# EAGLE design S2EC13 (EAGLE 7.4.0)
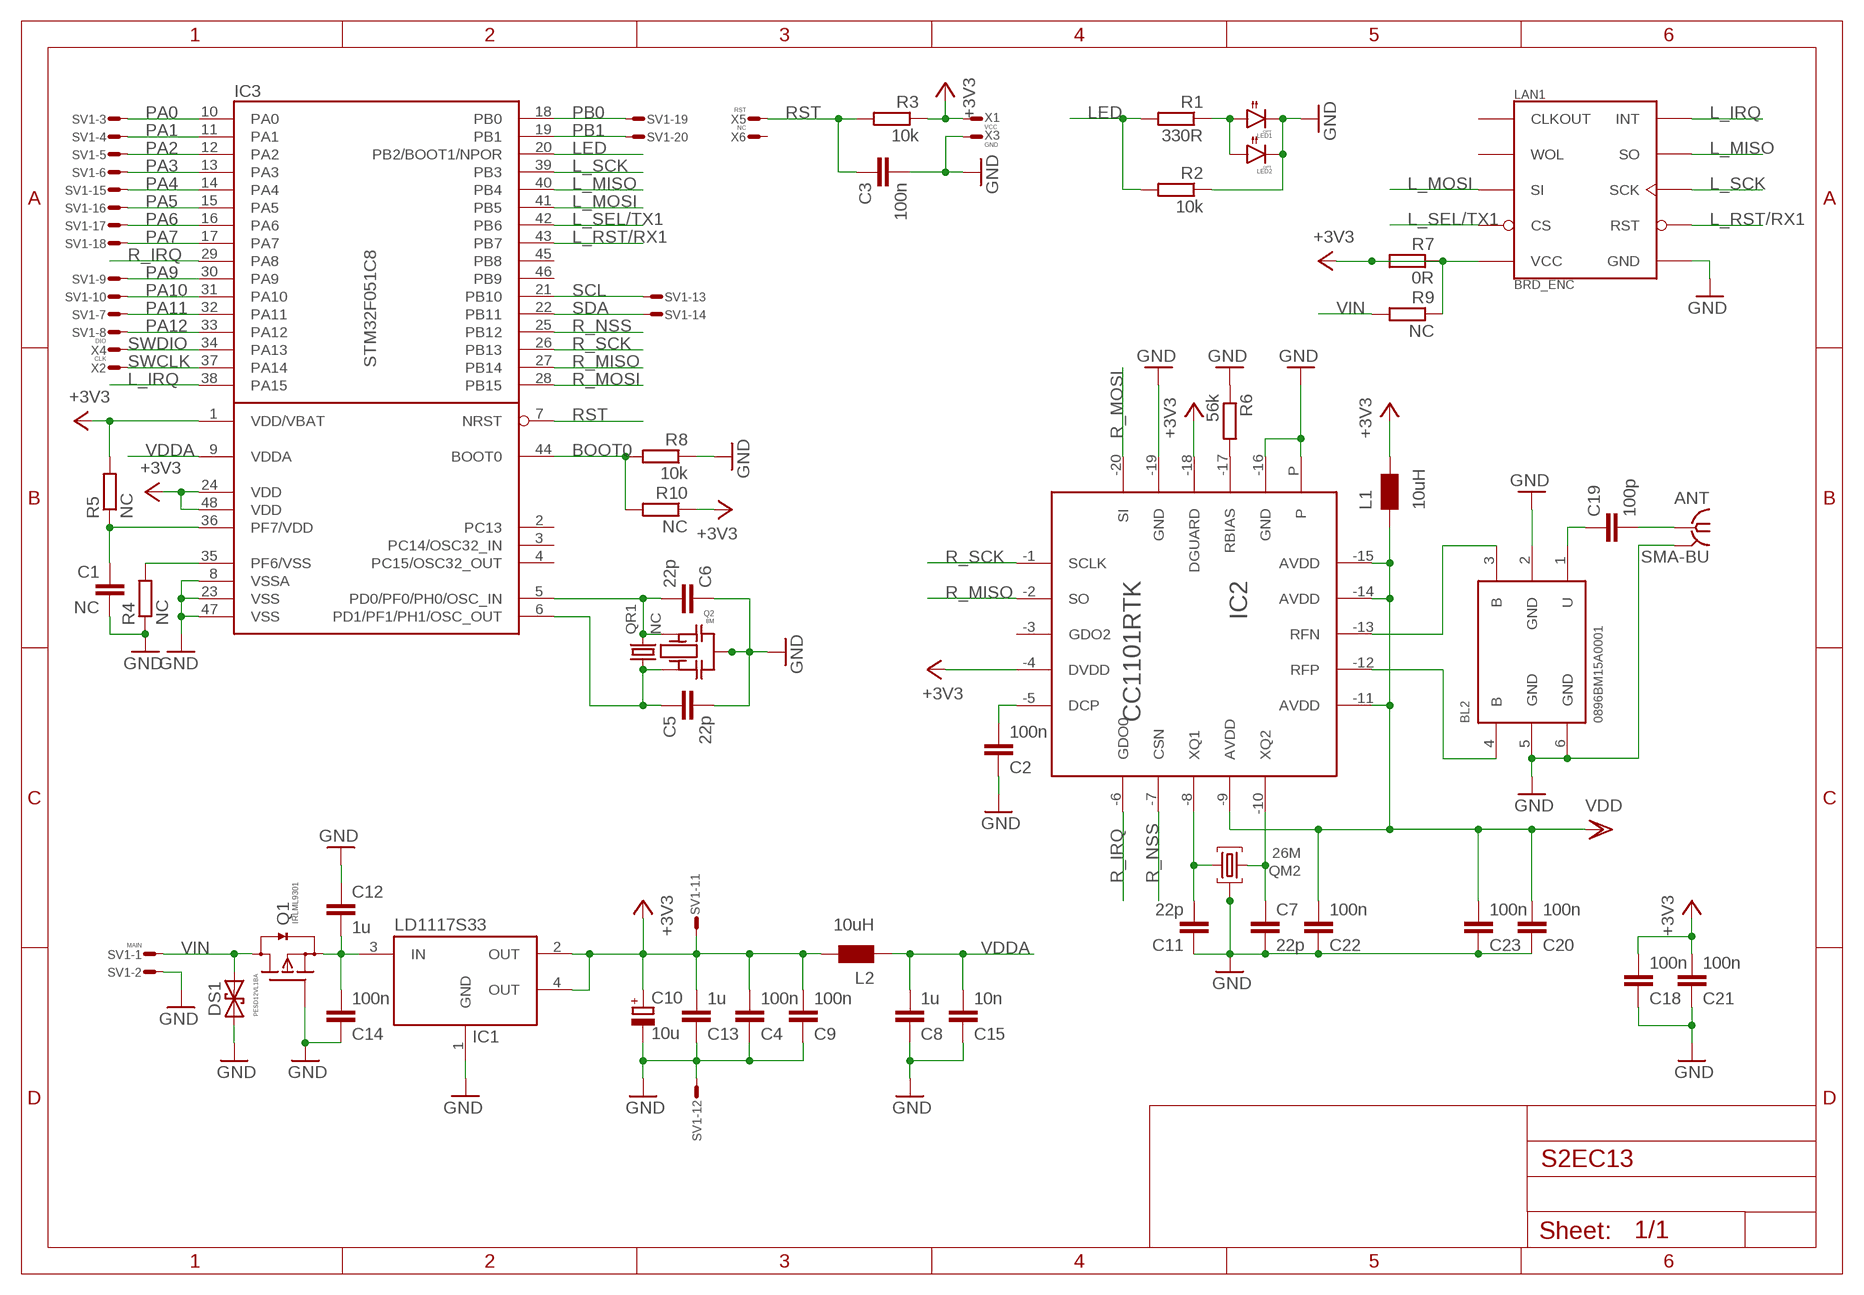
[diagram p0: schematic, sheet 1]

## Parts
ANT  SMA-BU  [BU-SMA-V]
BL2  0896BM15A0001  BL  [BL]
C1  NC  C0603  [0603]
C2  100n  C0603  [0603]
C3  100n  C0603  [0603]
C4  100n  C0603  [0603]
C5  22p  C0603  [0603]
C6  22p  C0603  [0603]
C7  22p  C0603  [0603]
C8  1u  C0603  [0603]
C9  100n  C0603  [0603]
C10  10u  C_POLSMCA  [SMC_A]
C11  22p  C0603  [0603]
C12  1u  C0603  [0603]
C13  1u  C0603  [0603]
C14  100n  C0603  [0603]
C15  10n  C0603  [0603]
C18  100n  C0603  [0603]
C19  100p  C0603  [0603]
C20  100n  C0603  [0603]
C21  100n  C0603  [0603]
C22  100n  C0603  [0603]
C23  100n  C0603  [0603]
DS1  PESD12VL1BA  TVS-U323  [SOD323]
IC1  LD1117S33  LDO_4P  [SOT223]
IC2  CC1101RTK  CC110LV  [VQFN20]
IC3  STM32F051C8  STM32_LQFP48  [LQFP48]
L1  10uH  L0603  [0603]
L2  10uH  L0603  [0603]
LAN1  BRD_ENC  [BRD_ENC]
LED1  OPT  LEDT134  [T1-3/4]
LED2  OPT  LED1206  [1206]
Q1  IRLML9301  FET-PDSOT23  [SOT23]
Q2  8M  QRCE  [CSTCE]
QM2  26M  QM3.2X2.5  [SMD_4P_3.2X2.5]
QR1  NC  QABS07  [ABS07]
R1  330R  R0603  [0603]
R2  10k  R0603  [0603]
R3  10k  R0603  [0603]
R4  NC  R0603  [0603]
R5  NC  R0603  [0603]
R6  56k  R0603  [0603]
R7  0R  R0603  [0603]
R8  10k  R0603  [0603]
R9  NC  R0603  [0603]
R10  NC  R0603  [0603]
SV1  MAIN  ML20LSE  [ML20LS]
X1  VCC  WIREPADT1.6/0.9  [T1.6/0.9]
X2  CLK  WIREPADT1.6/0.9  [T1.6/0.9]
X3  GND  WIREPADT1.6/0.9  [T1.6/0.9]
X4  DIO  WIREPADT1.6/0.9  [T1.6/0.9]
X5  RST  WIREPADT1.6/0.9  [T1.6/0.9]
X6  NC  WIREPADT1.6/0.9  [T1.6/0.9]

## Nets
+3V3: C4.2 C9.2 C10.+ C13.2 C18.2 C21.2 IC1.2(OUT) IC1.4(OUT) IC2.-4(DVDD) IC2.-18(DGUARD) IC3.1(VDD/VBAT) IC3.24(VDD) IC3.48(VDD) L1.2 L2.2 LAN1.P$9(VCC) R3.1 R5.2 R7.1 R7.2 R9.1 R10.1 SV1.P$11 X1.1(S)
BOOT0: IC3.44(BOOT0) R8.2 R10.2
GND: ANT.2 ANT.3 ANT.4 ANT.5 BL2.2(GND) BL2.5(GND) BL2.6(GND) C1.2 C2.1 C3.2 C4.1 C5.2 C6.1 C7.2 C8.1 C9.1 C10.- C11.1 C12.1 C13.1 C14.1 C15.1 C18.1 C20.1 C21.1 C22.1 C23.1 DS1.A IC1.1(GND) IC2.-16(GND) IC2.-19(GND) IC2.P IC3.8(VSSA) IC3.23(VSS) IC3.47(VSS) LAN1.P$10(GND) LED1.C LED2.2(C) Q1.1(G) Q2.G(M) QM2.2(M1) QM2.4(M2) R2.1 R4.1 R6.1 R8.1 SV1.P$2 SV1.P$12 X3.1(S)
L_IRQ: IC3.38(PA15) LAN1.P$2(INT)
L_MISO: IC3.40(PB4) LAN1.P$4(SO)
L_MOSI: IC3.41(PB5) LAN1.P$5(SI)
L_RST/RX1: IC3.43(PB7) LAN1.P$8(RST)
L_SCK: IC3.39(PB3) LAN1.P$6(SCK)
L_SEL/TX1: IC3.42(PB6) LAN1.P$7(CS)
LED: IC3.20(PB2/BOOT1/NPOR) R1.2 R2.2
N$1: LED1.A LED2.1(A) R1.1
N$2: IC3.35(PF6/VSS) R4.2
N$3: C1.1 IC3.36(PF7/VDD) R5.1
N$6: IC2.-17(RBIAS) R6.2
N$7: C2.2 IC2.-5(DCP)
N$8: BL2.3(B) IC2.-13(RFN)
N$9: BL2.4(B) IC2.-12(RFP)
N$11: C11.2 IC2.-8(XQ1) QM2.3
N$12: C7.1 IC2.-10(XQ2) QM2.1
N$13: BL2.1(U) C19.1
N$14: ANT.1 C19.2
N$20: C6.2 IC3.5(PD0/PF0/PH0/OSC_IN) Q2.A QR1.P$2
N$21: C5.1 IC3.6(PD1/PF1/PH1/OSC_OUT) Q2.B QR1.P$1
N$31: C12.2 C14.2 IC1.3(IN) Q1.2(S)
PA0: IC3.10(PA0) SV1.P$3
PA1: IC3.11(PA1) SV1.P$4
PA2: IC3.12(PA2) SV1.P$5
PA3: IC3.13(PA3) SV1.P$6
PA4: IC3.14(PA4) SV1.P$15
PA5: IC3.15(PA5) SV1.P$16
PA6: IC3.16(PA6) SV1.P$17
PA7: IC3.17(PA7) SV1.P$18
PA9: IC3.30(PA9) SV1.P$9
PA10: IC3.31(PA10) SV1.P$10
PA11: IC3.32(PA11) SV1.P$7
PA12: IC3.33(PA12) SV1.P$8
PB0: IC3.18(PB0) SV1.P$19
PB1: IC3.19(PB1) SV1.P$20
R_IRQ: IC2.-6(GDO0) IC3.29(PA8)
R_MISO: IC2.-2(SO) IC3.27(PB14)
R_MOSI: IC2.-20(SI) IC3.28(PB15)
R_NSS: IC2.-7(CSN) IC3.25(PB12)
R_SCK: IC2.-1(SCLK) IC3.26(PB13)
RST: C3.1 IC3.7(NRST) R3.2 X5.1(S)
SCL: IC3.21(PB10) SV1.P$13
SDA: IC3.22(PB11) SV1.P$14
SWCLK: IC3.37(PA14) X2.1(S)
SWDIO: IC3.34(PA13) X4.1(S)
VDD: C20.2 C22.2 C23.2 IC2.-9(AVDD) IC2.-11(AVDD) IC2.-14(AVDD) IC2.-15(AVDD) L1.1
VDDA: C8.2 C15.2 IC3.9(VDDA) L2.1
VIN: DS1.C Q1.3(D) R9.2 SV1.P$1
Unconnected: IC2.-3(GDO2) IC3.2(PC13) IC3.3(PC14/OSC32_IN) IC3.4(PC15/OSC32_OUT) IC3.45(PB8) IC3.46(PB9) LAN1.P$1(CLKOUT) LAN1.P$3(WOL) X6.1(S)

## Library data of the parts
ANT = Conn:SMA-: SMA 50 Ohm End Launch Jack Receptacle - Round Contact Johnson Components Source: www.johnsoncomponents.com .. J502-ND.pdf
BL2 = RF:BL
C1-C9 C11-C15 C18-C23 = RCL:C: Capacitor SMD
C10 = RCL:C_POL: POLARIZED CAPACITOR, European symbol
DS1 = Diode:TVS-U: DIODE
IC1 = DCDC:LDO_4P
IC2 = RF:CC110L
IC3 = STM32:STM32_LQFP48
L1 L2 = RCL:L
LAN1 = brd_enc:BRD_ENC
LED1 LED2 = Optic:LED
Q1 = Transistor:FET-PD
Q2 = QUARTZ:QR
QM2 = QUARTZ:QM
QR1 = QUARTZ:Q
R1-R10 = RCL:R: Resistor SMD
SV1 = Conn:ML20?E: HARTING
X1-X6 = Conn:WIREPAD: Wire PAD connect wire on PCB

## Board
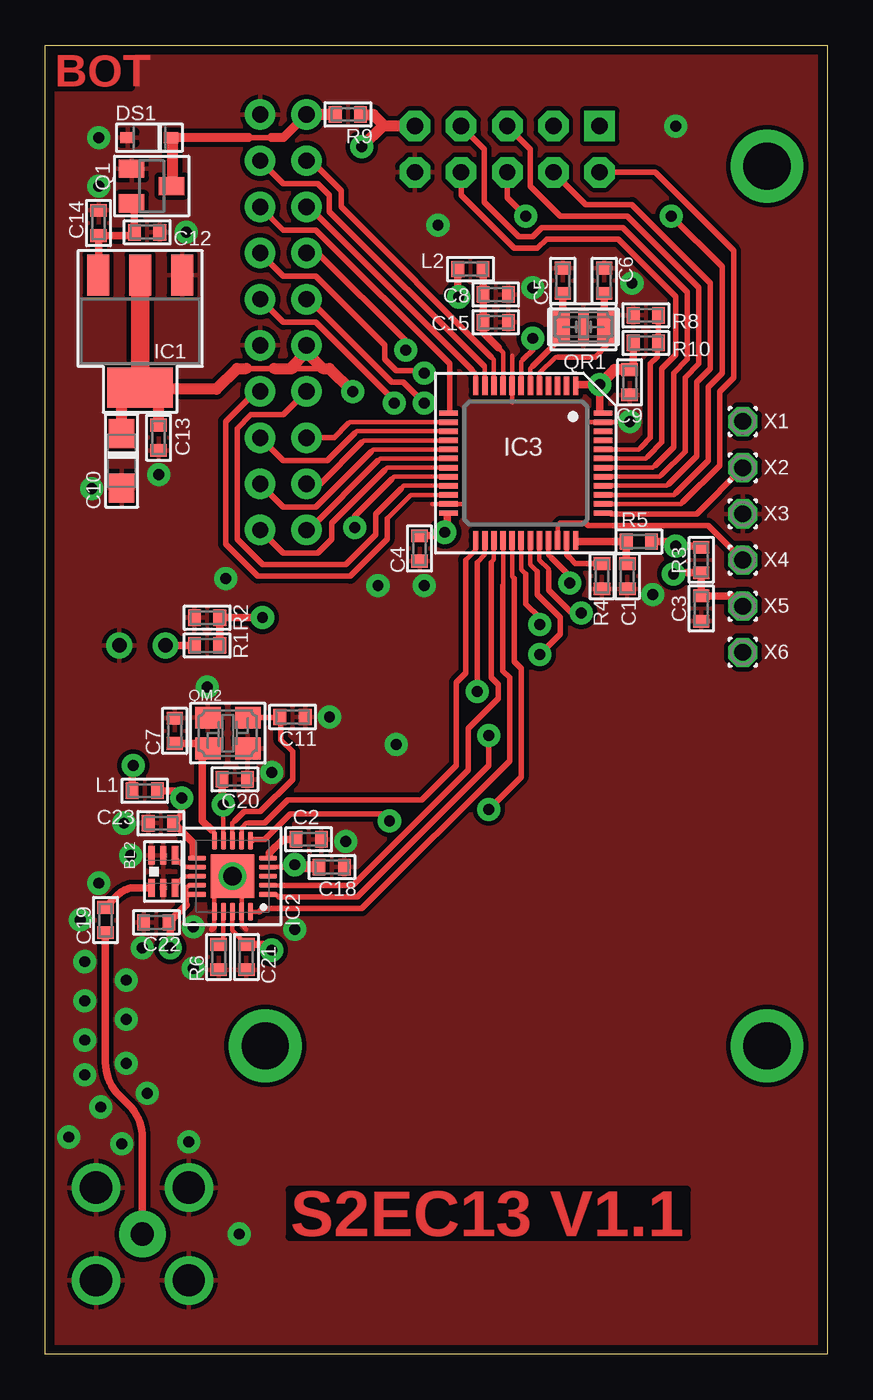
[diagram p1: board, top side]
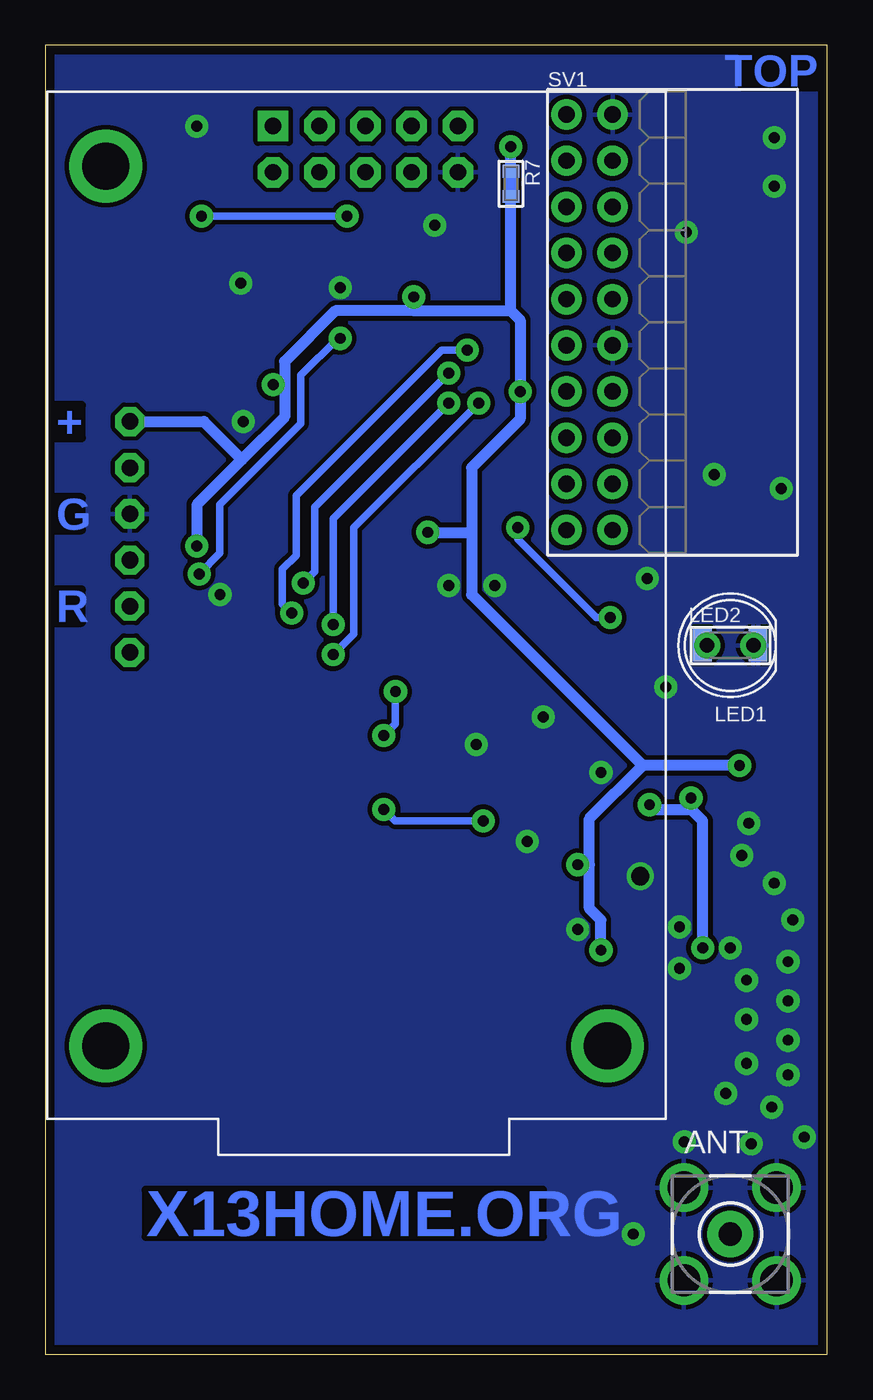
[diagram p2: board, bottom side, seen from below]

Size 43 x 72 mm. Coordinates in mm from the lower left corner, seen from the top.
Outline: 43,0 0,0 0,72 43,72 43,0
Copper layers (1*16): Top 0.035mm / dielectric 1.5mm / Bottom 0.035mm
Design rules "default *": minimum track width 12mil, minimum drill 0.5mm, track to track 10mil, track to pad 10mil, pad to pad 6mil, via to via 10mil, smd to smd 6mil, copper to edge 20mil, drill to drill 8mil, minimum pad ring 10mil, minimum via ring 8mil, stop-mask expansion 2mil, vias tented up to drill 25mil, thermal gap 10mil
tKeepout: area 0,0 to 43,2.5; area 0,69.5 to 43,72
bKeepout: area 0,0 to 43,1.3; area 0,70.7 to 43,72

### Footprints (pad centres in the part's own frame; a part is rotated, then mirrored left to right if it is on the bottom)
BU-SMA-V = drill 1.27 pad 2.54: 1 0,0 | drill 1.778: 2 -2.55,2.55; 3 2.55,2.55; 4 2.55,-2.55; 5 -2.55,-2.55
BL = smd 1 x 0.35: 1 0.9,-0.65; 2 0.9,0; 3 0.9,0.65; 4 -0.9,0.65; 5 -0.9,0; 6 -0.9,-0.65
0603 = smd 0.7 x 0.9: 1 -0.697,0; 2 0.697,0
SMC_A = smd 1.6 x 1.4: + -1.5,0; - 1.5,0
SOD323 = smd 0.8 x 0.6: A 1.2,0; C -1.2,0
SOT223 = smd 1.219 x 2.235: 1 -2.311,-3.099; 2 0,-3.099; 3 2.311,-3.099 | smd 3.6 x 2.2: 4 0,3.099
VQFN20 = smd 0.28 x 1: -1 -1,-1.95; -2 -0.5,-1.95; -3 0,-1.95; -4 0.5,-1.95; -5 1,-1.95; -11 1,1.95; -12 0.5,1.95; -13 0,1.95; -14 -0.5,1.95; -15 -1,1.95 | smd 1 x 0.28: -6 1.95,-1; -7 1.95,-0.5; -8 1.95,0; -9 1.95,0.5; -10 1.95,1; -16 -1.95,1; -17 -1.95,0.5; -18 -1.95,0; -19 -1.95,-0.5; -20 -1.95,-1 | smd 2.4 x 2.4: P 0,0
LQFP48 = smd 0.3 x 1: 1 -2.75,-4.25; 2 -2.25,-4.25; 3 -1.75,-4.25; 4 -1.25,-4.25; 5 -0.75,-4.25; 6 -0.25,-4.25; 7 0.25,-4.25; 8 0.75,-4.25; 9 1.25,-4.25; 10 1.75,-4.25; 11 2.25,-4.25; 12 2.75,-4.25; 25 2.75,4.25; 26 2.25,4.25; 27 1.75,4.25; 28 1.25,4.25; 29 0.75,4.25; 30 0.25,4.25; 31 -0.25,4.25; 32 -0.75,4.25; 33 -1.25,4.25; 34 -1.75,4.25; 35 -2.25,4.25; 36 -2.75,4.25 | smd 1 x 0.3: 13 4.25,-2.75; 14 4.25,-2.25; 15 4.25,-1.75; 16 4.25,-1.25; 17 4.25,-0.75; 18 4.25,-0.25; 19 4.25,0.25; 20 4.25,0.75; 21 4.25,1.25; 22 4.25,1.75; 23 4.25,2.25; 24 4.25,2.75; 37 -4.25,2.75; 38 -4.25,2.25; 39 -4.25,1.75; 40 -4.25,1.25; 41 -4.25,0.75; 42 -4.25,0.25; 43 -4.25,-0.25; 44 -4.25,-0.75; 45 -4.25,-1.25; 46 -4.25,-1.75; 47 -4.25,-2.25; 48 -4.25,-2.75
BRD_ENC = drill 0.9 pad 1.676 square: P$1 21.59,54.61 | drill 0.9 pad 1.676 octagon: P$2 21.59,52.07; P$3 19.05,54.61; P$4 19.05,52.07; P$5 16.51,54.61; P$6 16.51,52.07; P$7 13.97,54.61; P$8 13.97,52.07; P$9 11.43,54.61; P$10 11.43,52.07 | drill 2.6 pad 4: PAD@1 3.2,4; PAD@2 30.8,4; PAD@3 30.8,52.4
T1-3/4 = drill 0.8 pad 1.422: A 1.27,0; C -1.27,0
1206 = smd 1.016 x 1.778: 1 -1.524,0; 2 1.524,0
SOT23 = smd 1 x 1.4: 1 -0.95,-1.1; 2 0.95,-1.1; 3 0,1.1
CSTCE = smd 0.6 x 2: A -1.2,0; B 1.2,0; G 0,0
SMD_4P_3.2X2.5 = smd 1.4 x 1.2: 1 -1.1,-0.85; 2 1.1,-0.85; 3 1.1,0.85; 4 -1.1,0.85
ABS07 = smd 1 x 1.8: P$1 -1.25,0; P$2 1.25,0
ML20LS = drill 0.9 pad 1.676: P$1 -11.43,-1.27; P$2 -11.43,1.27; P$3 -8.89,-1.27; P$4 -8.89,1.27; P$5 -6.35,-1.27; P$6 -6.35,1.27; P$7 -3.81,-1.27; P$8 -3.81,1.27; P$9 -1.27,-1.27; P$10 -1.27,1.27; P$11 1.27,-1.27; P$12 1.27,1.27; P$13 3.81,-1.27; P$14 3.81,1.27; P$15 6.35,-1.27; P$16 6.35,1.27; P$17 8.89,-1.27; P$18 8.89,1.27; P$19 11.43,-1.27; P$20 11.43,1.27
T1.6/0.9 = drill 0.914 pad 1.6 octagon: 1 0,0

### Placement (x,y rotation side)
ANT  5.33,6.6 0 bottom
BL2  6.48,26.54 270 top
C1  32,42.8 270 top
C2  14.48,28.32 180 top
C3  36.07,41.02 270 top
C4  20.57,44.32 90 top
C5  28.45,59.05 90 top
C6  30.73,59.05 270 top
C7  7.11,34.29 90 top
C8  24.77,58.29 180 top
C9  32.13,53.47 90 top
C10  4.19,49.15 270 top
C11  13.59,35.05 180 top
C12  5.59,61.72 180 top
C13  6.22,50.42 90 top
C14  2.92,62.23 270 top
C15  24.77,56.77 180 top
C18  15.75,26.8 180 top
C19  3.3,23.88 270 top
C20  10.41,31.62 180 top
C21  11.05,21.84 90 top
C22  6.1,23.75 0 top
C23  6.35,29.21 0 top
DS1  5.71,66.93 180 top
IC1  5.21,56.26 180 top
IC2  10.29,26.29 90 top
IC3  26.42,49.02 180 top
L1  5.46,30.99 180 top
L2  23.37,59.69 180 top
LAN1  8.89,12.95 0 top
LED1  5.33,38.99 180 bottom
LED2  5.33,38.99 0 bottom
Q1  5.84,64.26 270 top
Q2  29.59,56.52 180 top
QM2  10.03,34.16 0 top
QR1  29.59,56.52 0 top
R1  8.89,38.99 0 top
R2  8.89,40.51 0 top
R3  36.07,43.69 270 top
R4  30.61,42.8 90 top
R5  32.64,44.7 0 top
R6  9.53,21.84 90 top
R7  17.4,64.39 270 bottom
R8  33.02,57.15 0 top
R9  16.64,68.2 180 top
R10  33.02,55.63 0 top
SV1  13.08,56.77 270 bottom
X1  38.35,51.31 0 top
X2  38.35,48.77 0 top
X3  38.35,46.23 0 top
X4  38.35,43.69 0 top
X5  38.35,41.15 0 top
X6  38.35,38.61 0 top

### Tracks (layer width: path | path; a pad name or v marks a point on that pad's centre or on a via)
+3V3  (via drill 0.6 pad 1.27)
  Top 0.254: IC3.1 29.27,53.27 | IC2.-18 10.29,23.3 C21.2 | IC3.24 22.17,46.17 22.1,46.1 | IC3.48 30.65,51.77 30.48,51.94 | IC2.-4 12.95,26.79 12.95,26.8
  Top 0.305: 29.27,53.27 29.34,53.34 | 11.05,54.23 12.57,54.23 | 13.59,54.23 15.24,54.23 | 32.32,54.36 C9.2 | 12.95,26.8 13.59,26.8 v13.72,26.92
  Top 0.406: 29.34,53.34 v30.48,53.34 30.48,51.94 | C4.2 21.78,45.02 v21.97,45.21 22.1,45.34 22.1,46.1 | v22.73,58.17 22.67,58.23 L2.2 | C21.2 12.13,22.54 v12.45,22.23 | L1.2 4.76,32.32 v4.83,32.38 | R10.1 32.32,54.36 | R5.2 34.42,44.7 v34.67,44.45 36,44.45 R3.1
  Top 0.61: 6.1,53.09 9.4,53.09 10.54,54.23 11.05,54.23 | 6.1,53.09 5.28,53.09 IC1.4 5.13,53.09 4.19,53.09 C10.+ | v16.89,52.96 15.62,54.23 15.24,54.23 14.35,55.12 | LAN1.P$9 18.67,67.56 | 18.67,67.56 18.54,67.56 v17.4,66.42 | C13.2 6.22,52.96 6.1,53.09 | R9.1 18.03,68.2 18.67,67.56 | 12.57,54.23 13.46,54.23 | 13.46,54.23 13.59,54.23 | SV1.P$11 14.35,55.12 | 14.35,55.12 13.46,54.23 | v30.48,53.34 31.3,54.16 C9.2 | C18.2 13.84,26.8 v13.72,26.92
  Top 1.016: IC1.2 IC1.4
  Bottom 0.61: v4.83,32.38 10.16,32.38 | 19.56,45.21 19.56,48.77 16.89,51.44 v16.89,52.96 16.89,56.9 17.4,57.4 | v21.97,45.21 19.56,45.21 | 19.56,45.21 19.56,41.78 10.16,32.38 | 22.73,57.4 17.4,57.4 | 17.4,57.4 R7.2 R7.1 v17.4,66.42 | v22.73,58.17 22.73,57.4 | 29.84,53.34 29.84,54.61 27.05,57.4 22.73,57.4 | 29.84,53.34 29.84,51.56 32.19,49.21 | 32.19,49.21 34.67,46.74 v34.67,44.45 | X1.1 34.29,51.31 32.19,49.21 | v30.48,53.34 29.84,53.34 | v12.45,22.23 12.45,23.88 13.08,24.51 13.08,26.92 | 13.08,26.92 13.08,29.46 10.16,32.38 | v13.72,26.92 13.08,26.92
BOOT0
  Top 0.254: IC3.44 32.63,49.77 32.77,49.91
  Top 0.305: 32.77,49.91 33.27,50.42 33.27,54.48 33.66,54.86 33.66,55.56 R10.2 R8.2
GND  (via drill 0.6 pad 1.27, 1 pad 1.27)
  Top 0.254: 25.67,52.34 IC3.8 25.67,54.92 | IC3.47 31.41,51.27 | 29.9,51.27 30.64,51.27 | 22.95,46.77 IC3.23 21.28,46.77 | 9.29,25.16 IC2.-16 9.29,23.51 | 10.79,25.79 IC2.-19 10.79,23.63 11.05,23.37
  Top 0.305: 10.79,25.79 IC2.P | 9.29,23.51 9.14,23.37
  other vias: 2.92,66.93 32.13,51.31 26.8,58.67 32.26,58.93 12.45,32 16.51,28.19 10.29,26.29 5.33,22.35 13.72,23.37 8.13,23.5 4.7,27.43 4.32,29.21 7.75,61.72 6.22,48.39 20.83,42.29 18.29,42.29 33.4,41.78 34.67,67.56 15.62,35.05 8.89,36.7 21.59,62.1 9.91,42.67 2.54,47.62 19.3,33.53 8.13,21.21 4.45,20.57 4.45,18.41 4.45,16 5.59,14.35 7.87,11.68 10.67,6.6 4.19,11.56 3.05,13.59 2.16,17.27 2.16,19.43 2.16,21.59 2.92,25.91 1.91,23.88 1.27,11.94 2.16,15.37 2.92,64.26
  pour Bottom: 43,0 0,0 0,72 43,72
  pour Top: 43,0 0,0 0,72 43,72
L_IRQ
  Top 0.254: IC3.38 34.96,46.77 35.05,46.86
  Top 0.305: LAN1.P$2 33.53,65.02 37.85,60.71 37.85,53.72 37.08,52.96 37.08,48.9 35.05,46.86
L_MISO
  Top 0.254: IC3.40 34.18,47.77 34.29,47.88
  Top 0.305: 34.29,47.88 35.81,49.4 35.81,53.47 36.58,54.23 36.58,58.93 32.26,63.25 29.72,63.25 LAN1.P$4
L_MOSI
  Top 0.254: IC3.41 33.79,48.27 33.91,48.39
  Top 0.305: LAN1.P$5 26.67,66.29 26.67,64.26 28.32,62.61 32,62.61 35.94,58.67 35.94,54.48 35.18,53.72 35.18,49.66 33.91,48.39
L_RST/RX1
  Top 0.254: IC3.43 33.02,49.27 33.15,49.4
  Top 0.305: 22.86,64.9 LAN1.P$8 22.86,63.75 25.78,60.83 27.05,60.83 27.56,61.34 31.5,61.34 34.67,58.17 34.67,54.99 33.91,54.23 33.91,50.16 33.15,49.4
L_SCK  (via drill 0.6 pad 1.27)
  Top 0.254: IC3.39 34.57,47.27 34.67,47.37
  Top 0.305: LAN1.P$6 25.4,63.63 v26.42,62.61 | 34.67,47.37 36.45,49.15 36.45,53.21 37.21,53.98 37.21,59.82 v34.42,62.61
  Bottom 0.406: v34.42,62.61 v26.42,62.61
L_SEL/TX1
  Top 0.254: IC3.42 33.41,48.77 33.53,48.9
  Top 0.305: LAN1.P$7 24.13,66.29 24.13,63.37 26.04,61.47 26.8,61.47 27.3,61.98 31.75,61.98 35.31,58.42 35.31,54.74 34.54,53.98 34.54,49.91 33.53,48.9
LED  (via drill 0.6 pad 1.27)
  Top 0.254: IC3.20 19.19,48.27 19.05,48.13
  Top 0.305: 19.05,48.13 17.02,46.1 v17.02,45.47
  Top 0.406: v11.94,40.51 R2.2 R1.2
  Bottom 0.406: v17.02,45.47 17.02,44.83 12.7,40.51 v11.94,40.51
N$1
  Top 0.406: R1.1 LED1.A
  Bottom 0.406: LED2.1 LED1.A
N$2
  Top 0.254: IC3.35 28.67,43.98
  Top 0.305: 28.67,43.98 28.83,43.81 29.15,43.5 R4.2
N$3
  Top 0.254: IC3.36 29.27,44.77
  Top 0.305: 29.27,44.77 29.34,44.7
  Top 0.406: C1.1 31.94,43.56 R5.1 29.34,44.7
N$6
  Top 0.254: IC2.-17 9.79,22.8
  Top 0.305: 9.79,22.8 R6.2
N$7
  Top 0.254: IC2.-5 12.24,27.35
  Top 0.305: 12.24,27.35 12.32,27.43
  Top 0.406: 12.32,27.43 12.32,27.56 13.08,28.32 C2.2
N$8
  Top 0.254: IC2.-13 7.62,26.29 7.13,25.8
  Top 0.305: BL2.3 7.13,25.8
N$9
  Top 0.254: IC2.-12 7.63,26.79 7.13,27.29
  Top 0.305: BL2.4 7.13,27.29
N$11
  Top 0.254: IC2.-8 10.29,29.21 10.41,29.34
  Top 0.305: QM2.3 12.85,35.01 C11.2 12.95,34.99 12.95,33.78 13.59,33.15 13.59,31.62 11.81,29.84 10.92,29.84 10.41,29.34
N$12
  Top 0.254: IC2.-10 9.29,28.69 9.14,28.83
  Top 0.406: 9.14,28.83 8.64,29.34 8.64,33.02 QM2.1 8.65,33.59 C7.1
N$13
  Top 0.254: BL2.1 arc45 5.8,25.65 5.71,25.65
  Top 0.406: 5.71,25.65 4.91,25.65 arc45 4.01,25.28 C19.1
N$14
  Top 0.406: C19.2 3.3,16.04 arc45 4.05,14.24 4.59,13.7 arc-45 5.33,11.9 ANT.1
N$20
  Top 0.254: IC3.5 27.17,53.96 28.07,54.86 28.19,54.86
  Top 0.305: 28.19,54.86 30.23,54.86 30.84,55.48 QR1.P$2 | 30.73,56.46 Q2.A
  Top 0.406: C6.2 30.73,56.62 QR1.P$2
  Top 0.61: Q2.A QR1.P$2
N$21
  Top 0.254: IC3.6 26.67,54.23 26.8,54.36
  Top 0.305: 28.32,56.39 28.32,56.49 QR1.P$1 | 26.8,54.36 28.39,55.95 Q2.B
  Top 0.406: C5.1 28.45,56.57 Q2.B
  Top 0.61: Q2.B QR1.P$1
N$31
  Top 0.406: IC1.3 2.92,59.38 C14.2 4.7,61.53 C12.2 4.89,63.16 Q1.2
PA0
  Top 0.254: IC3.10 24.67,54.71 24.51,54.86
  Top 0.305: 24.51,54.86 16.26,63.12 16.26,64.01 14.61,65.66 SV1.P$3
PA1
  Top 0.254: IC3.11 24.17,54.32 24.13,54.36
  Top 0.305: 24.13,54.36 15.62,62.87 15.62,63.75 14.99,64.39 13.08,64.39 SV1.P$4
PA2
  Top 0.254: IC3.12 23.67,53.93 23.56,54.04
  Top 0.305: 23.56,54.04 23.44,54.16 14.48,63.12 SV1.P$5
PA3
  Top 0.254: IC3.13 22.18,51.77 22.23,51.82
  Top 0.305: SV1.P$6 13.08,61.85 14.86,61.85 22.23,54.48 22.23,51.82
PA4
  Top 0.254: IC3.14 16.73,51.27 16.64,51.18
  Top 0.305: SV1.P$15 15.88,50.42 16.64,51.18
PA5
  Top 0.254: IC3.15 17.12,50.77 17.02,50.67
  Top 0.305: 17.02,50.67 15.49,49.15 13.08,49.15 SV1.P$16
PA6
  Top 0.254: IC3.16 17.51,50.27 17.4,50.16
  Top 0.305: 17.4,50.16 15.11,47.88 SV1.P$17
PA7
  Top 0.254: IC3.17 18.02,49.77 17.91,49.66
  Top 0.305: SV1.P$18 13.08,46.61 14.86,46.61 17.91,49.66
PA9  (via drill 0.6 pad 1.27)
  Top 0.254: IC3.30 26.17,43.18 26.42,42.93
  Top 0.305: v27.18,40.13 27.18,40.51 26.42,41.27 26.42,42.93 | SV1.P$9 14.48,58.04 19.05,53.47 19.68,53.47 v20.83,52.32
  Bottom 0.406: v20.83,52.32 27.18,45.97 v27.18,40.13
PA10  (via drill 0.6 pad 1.27)
  Top 0.254: IC3.31 26.67,43.44 27.05,43.05
  Top 0.305: SV1.P$10 13.08,56.77 14.86,56.77 19.18,52.45 v19.18,52.32 | 27.05,43.05 27.05,41.78 28.32,40.51 28.32,39.62 v27.18,38.48
  Bottom 0.406: v19.18,52.32 26.04,45.47 26.04,39.62 v27.18,38.48
PA11  (via drill 0.6 pad 1.27)
  Top 0.254: IC3.32 27.17,43.7 27.69,43.18 27.69,43.05
  Top 0.305: v19.81,55.24 19.81,55.75 14.99,60.58 SV1.P$7 | 27.69,43.05 27.69,42.04 28.96,40.77 v29.46,40.77
  Bottom 0.406: v19.81,55.24 21.21,55.24 29.21,47.24 29.21,43.94 29.97,43.18 29.97,41.27 v29.46,40.77
PA12  (via drill 0.6 pad 1.27)
  Top 0.254: IC3.33 27.67,43.96 27.81,43.81
  Top 0.305: SV1.P$8 13.08,59.31 14.86,59.31 18.67,55.5 18.67,54.74 19.3,54.1 20.7,54.1 v20.83,53.98 | 27.81,43.81 28.83,42.8 v28.83,42.42
  Bottom 0.406: v20.83,53.98 28.19,46.61 28.19,43.05 v28.83,42.42
PB0
  Top 0.254: IC3.18 18.41,49.27 18.29,49.15
  Top 0.305: 18.29,49.15 14.48,45.34 SV1.P$19
PB1
  Top 0.254: IC3.19 18.8,48.77 18.67,48.64
  Top 0.305: 18.67,48.64 15.75,45.72 15.75,44.83 14.99,44.07 13.08,44.07 SV1.P$20
R_IRQ  (via drill 0.6 pad 1.27)
  Top 0.254: IC2.-6 11.35,28.24 | IC3.29 25.67,42.79 25.78,42.67
  Top 0.305: 11.35,28.24 11.43,28.32 12.06,28.32 13.46,29.72 18.54,29.72 v18.92,29.34 | 25.78,42.67 25.78,38.1 26.16,37.72 26.16,31.75 v24.38,29.97
  Bottom 0.406: v18.92,29.34 23.75,29.34 v24.38,29.97
R_MISO
  Top 0.254: IC3.27 24.67,43.72 24.51,43.56 | IC2.-2 12.95,25.79 12.95,25.78
  Top 0.305: 12.95,25.78 16.89,25.78 23.24,32.13 23.24,34.42 24.89,36.07 24.89,36.83 24.51,37.21 24.51,43.56
R_MOSI
  Top 0.254: IC2.-20 11.77,24.34 | IC3.28 25.17,42.31 25.15,42.29
  Top 0.305: 11.77,24.34 11.94,24.51 17.4,24.51 25.53,32.64 25.53,37.21 25.15,37.59 25.15,42.29
R_NSS
  Top 0.254: IC2.-7 10.79,28.95 11.05,29.21 11.18,29.21 | IC3.25 23.67,44.24 23.11,43.69
  Top 0.305: 23.11,43.69 23.11,37.47 22.61,36.96 22.61,32.38 20.7,30.48 13.34,30.48 12.06,29.21 11.18,29.21
R_SCK  (via drill 0.6 pad 1.27)
  Top 0.254: IC3.26 24.17,43.98 23.75,43.56 | IC2.-1 12.68,25.29 12.83,25.15
  Top 0.305: 23.75,43.56 v23.75,36.45 | 12.83,25.15 17.14,25.15 24.38,32.38 v24.38,34.04
  Bottom 0.406: v23.75,36.45 23.75,34.67 v24.38,34.04
RST  (via drill 0.6 pad 1.27)
  Top 0.254: IC3.7 26.17,54.61 26.29,54.74
  Top 0.305: 26.29,54.74 26.8,55.24 v26.8,55.88
  Top 0.406: X5.1 37.78,41.72 C3.1 R3.2 34.61,42.99 v34.54,42.93
  Bottom 0.406: v34.54,42.93 33.4,44.07 33.4,46.74 28.96,51.18 28.96,53.85 26.92,55.88 v26.8,55.88
SCL
  Top 0.254: IC3.21 19.7,47.77 19.56,47.62
  Top 0.305: 19.56,47.62 18.16,46.23 18.16,45.09 16.51,43.43 11.94,43.43 10.54,44.83 10.54,50.93 11.3,51.69 13.08,51.69 SV1.P$13
SDA
  Top 0.254: IC3.22 20.09,47.27 18.8,45.97
  Top 0.305: 18.8,45.97 18.8,44.83 16.76,42.8 11.68,42.8 9.91,44.58 9.91,51.31 11.56,52.96 SV1.P$14
SWCLK
  Top 0.254: IC3.37 31.07,46.27 31.11,46.23
  Top 0.305: 31.11,46.23 35.81,46.23 X2.1
SWDIO
  Top 0.254: IC3.34 28.17,45.56 28.32,45.72
  Top 0.305: 28.32,45.72 29.72,45.72 29.84,45.59 36.45,45.59 X4.1
VDD  (via drill 0.6 pad 1.27)
  Top 0.254: IC2.-14 7.88,25.79 7.75,25.65 7.75,25.27 7.76,25.29 IC2.-15 | IC2.-11 8.27,27.29 8.13,27.43 | IC2.-9 9.79,28.69 9.78,28.7 v9.78,30.23
  Top 0.305: 7.75,25.27 7.75,24.89 7.75,24.7
  Top 0.406: 8.13,27.43 8.13,28.13 C23.2 7.49,29.66 v7.49,30.61 7.11,30.99 L1.1 | v6.86,22.35 6.86,23.68 C22.2 7.75,24.7 | C20.2 9.72,30.29 v9.78,30.23
  Bottom 0.61: v6.86,22.35 6.86,29.34 7.49,29.97 | v9.78,30.23 9.53,29.97 7.49,29.97 | v7.49,30.61 7.49,29.97
VDDA
  Top 0.254: IC3.9 25.17,55.1 24.89,55.37
  Top 0.406: 24.89,55.37 24.07,56.2 C15.2 C8.2 L2.1
VIN
  Top 0.305: 12.45,66.93 11.18,66.93
  Top 0.406: 6.92,64.29 Q1.3 | DS1.C 6.92,66.75 6.99,66.67
  Top 0.508: SV1.P$1 13.08,66.93 12.45,66.93 | 11.18,66.93 DS1.C
  Top 0.61: R9.2 SV1.P$1 | 6.99,66.67 6.99,64.31 Q1.3

### Text on the board
Top: BOT | S2EC13 V1.1
Bottom: TOP | + | G | R | X13HOME.ORG